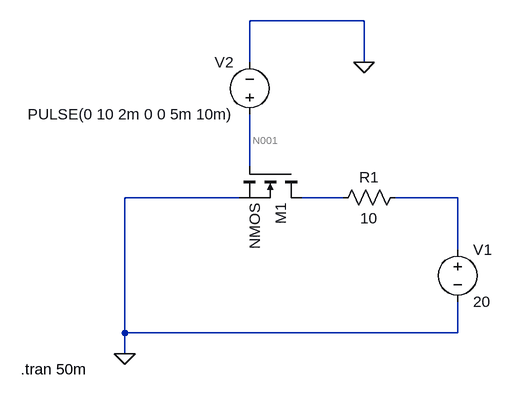
[diagram p0: schematic pnp_v2.asc]
pnp_v2.asc, the LTspice schematic file:
Version 4.1
SHEET 1 880 680
WIRE 320 -208 144 -208
WIRE 144 -144 144 -208
WIRE 320 -144 320 -208
WIRE 144 16 144 -64
WIRE 128 64 -48 64
WIRE 288 64 224 64
WIRE 464 64 368 64
WIRE 464 144 464 64
WIRE -48 272 -48 64
WIRE 464 272 464 224
WIRE 464 272 -48 272
WIRE -48 304 -48 272
FLAG -48 304 0
FLAG 320 -144 0
SYMBOL voltage 144 -48 R180
WINDOW 0 24 96 Left 2
WINDOW 3 24 16 Left 2
WINDOW 123 0 0 Left 0
WINDOW 39 0 0 Left 0
SYMATTR InstName V2
SYMATTR Value PULSE(0 10 2m 0 0 5m 10m)
SYMBOL nmos 224 16 R90
SYMATTR InstName M1
SYMBOL voltage 464 128 R0
WINDOW 123 0 0 Left 0
WINDOW 39 0 0 Left 0
SYMATTR InstName V1
SYMATTR Value 20
SYMBOL res 384 48 R90
WINDOW 0 0 56 VBottom 2
WINDOW 3 32 56 VTop 2
SYMATTR InstName R1
SYMATTR Value 10
TEXT -208 328 Left 2 !.tran 50m

The netlist it stands for:
* pnp_v2.asc
V2 N001 0 PULSE(0 10 2m 0 0 5m 10m)
M1 N002 N001 0 0 NMOS
V1 N003 0 20
R1 N003 N002 10
.model NMOS NMOS
.model PMOS PMOS
.lib standard.mos
.tran 50m
.backanno
.end

* Results of the author's LTspice run, read from the files saved beside the schematic
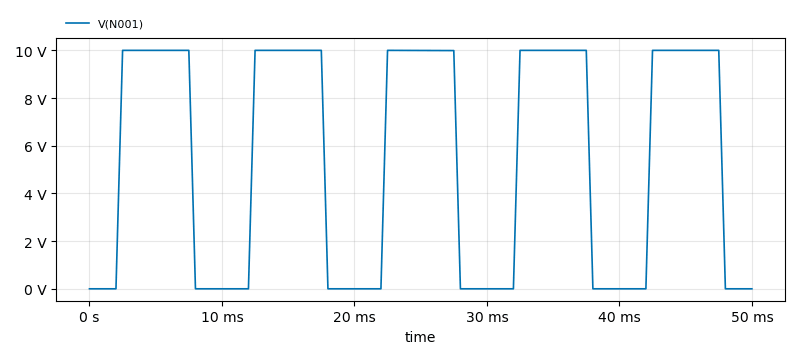
[diagram p1: Transient Analysis of pnp_v2.asc, plotted from the saved traces]
* Transient Analysis, 1 run:
*   V(N001): min 0 V, max 10 V, average 5.5 V, rms 7.314 V, last 0 V